# Altium schematic sheet Top Level.SchDoc
size A2
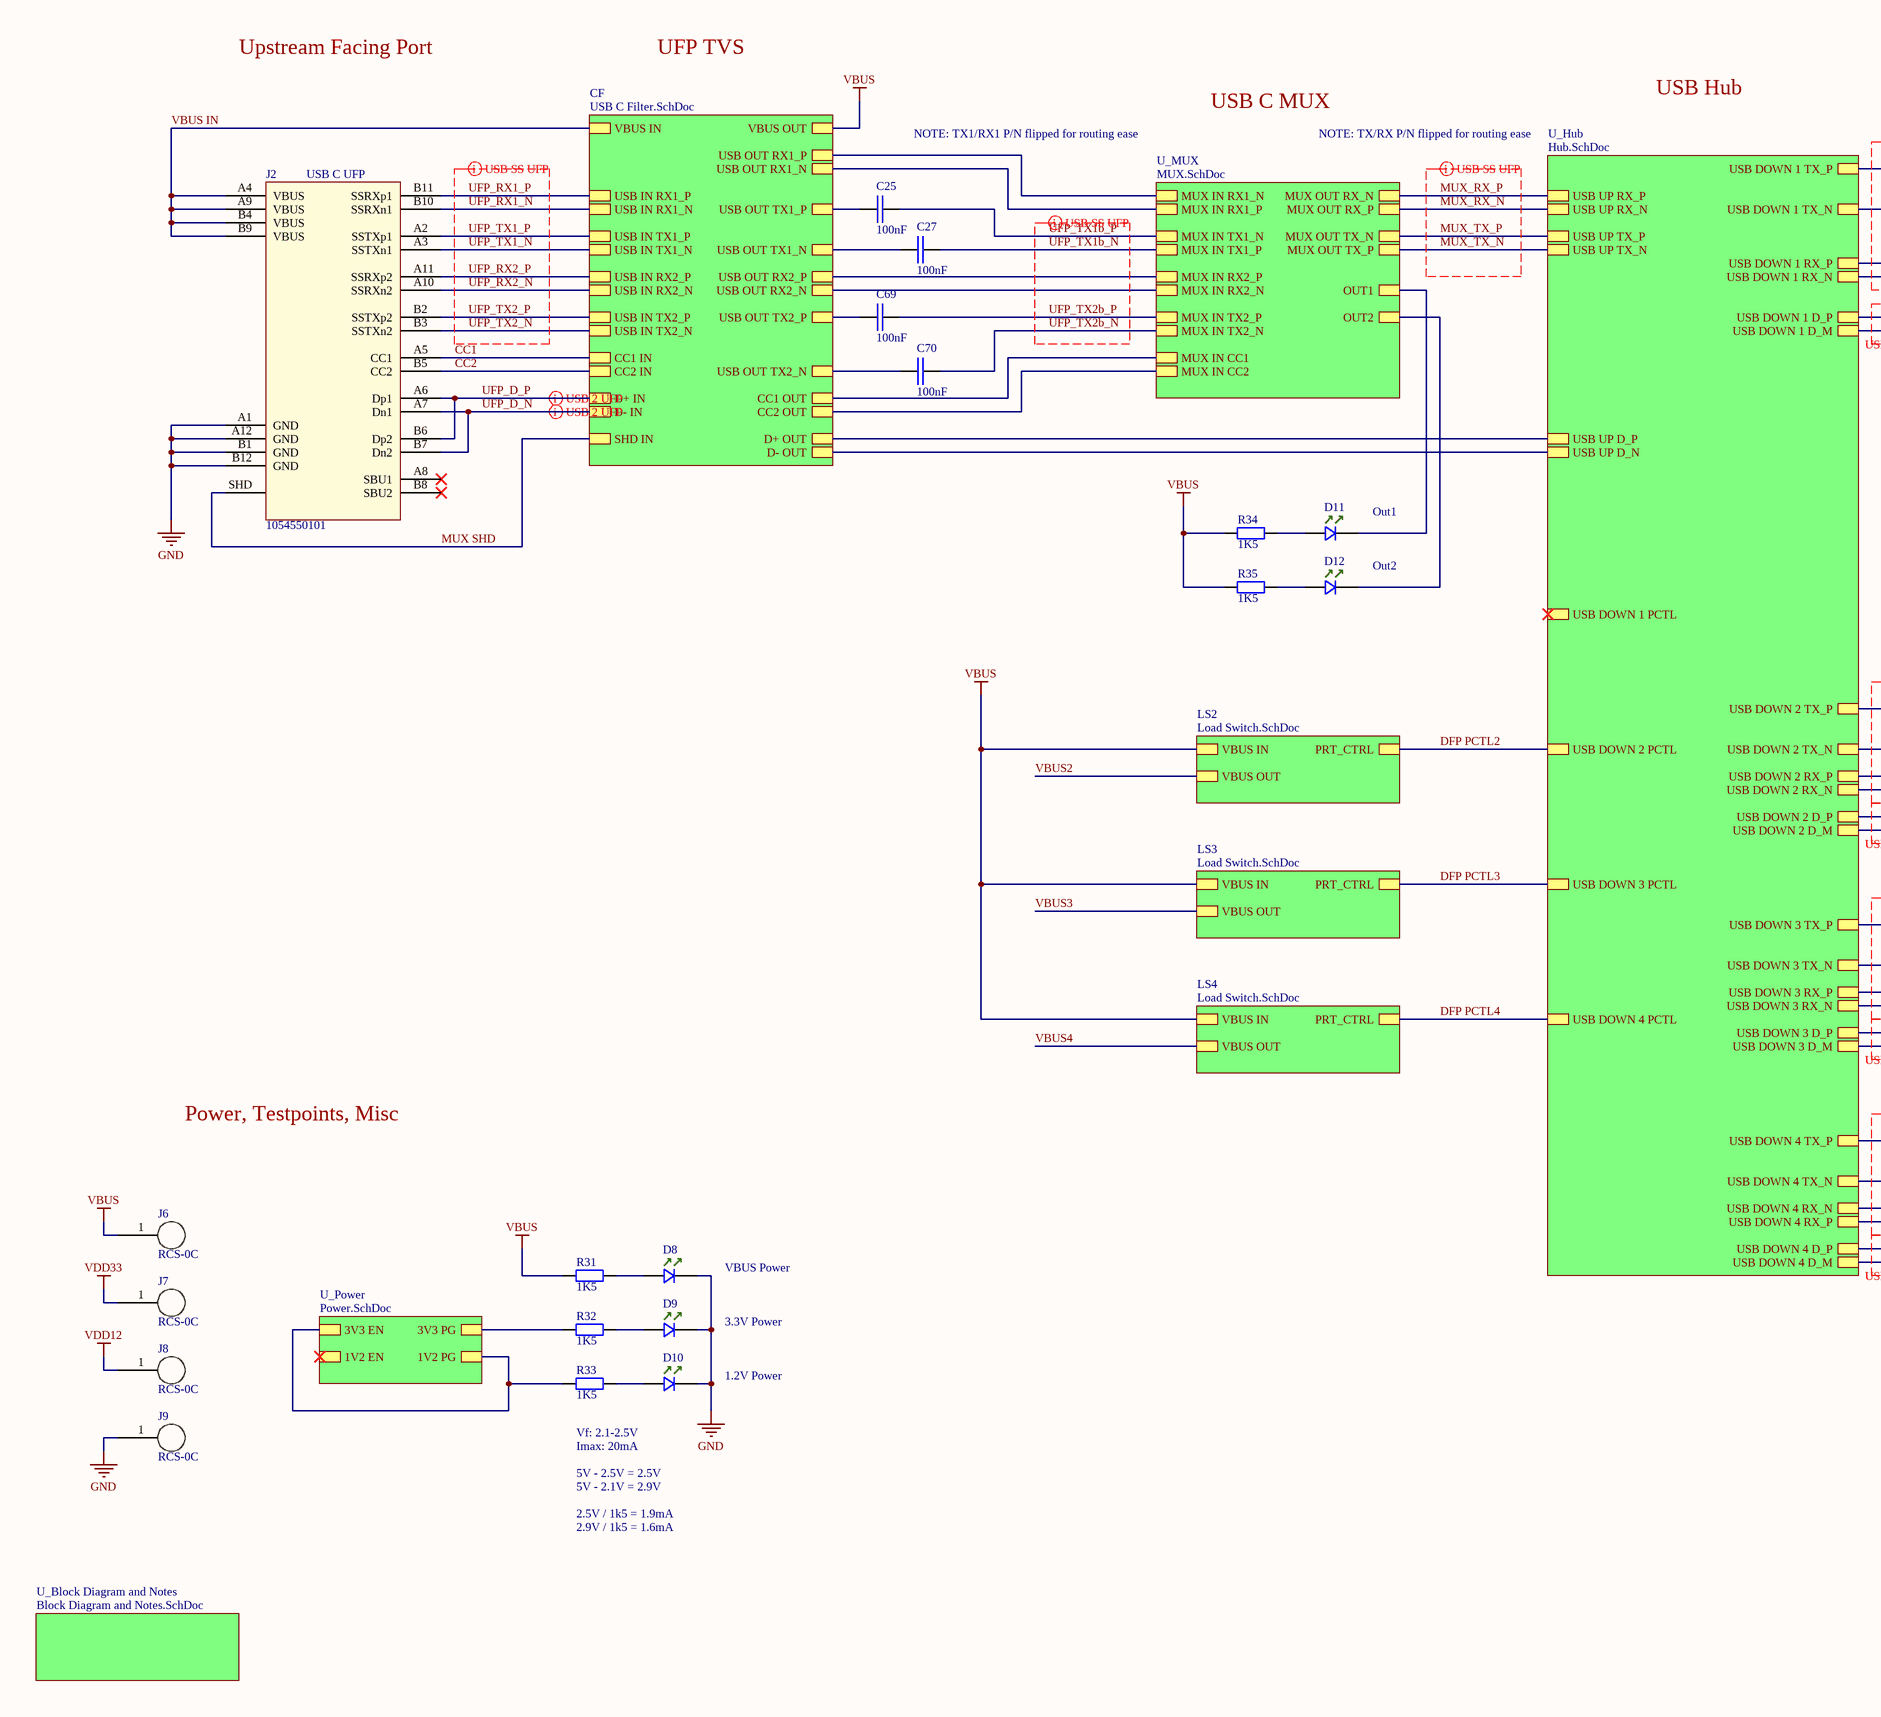
[diagram p0: Top Level.SchDoc, left]
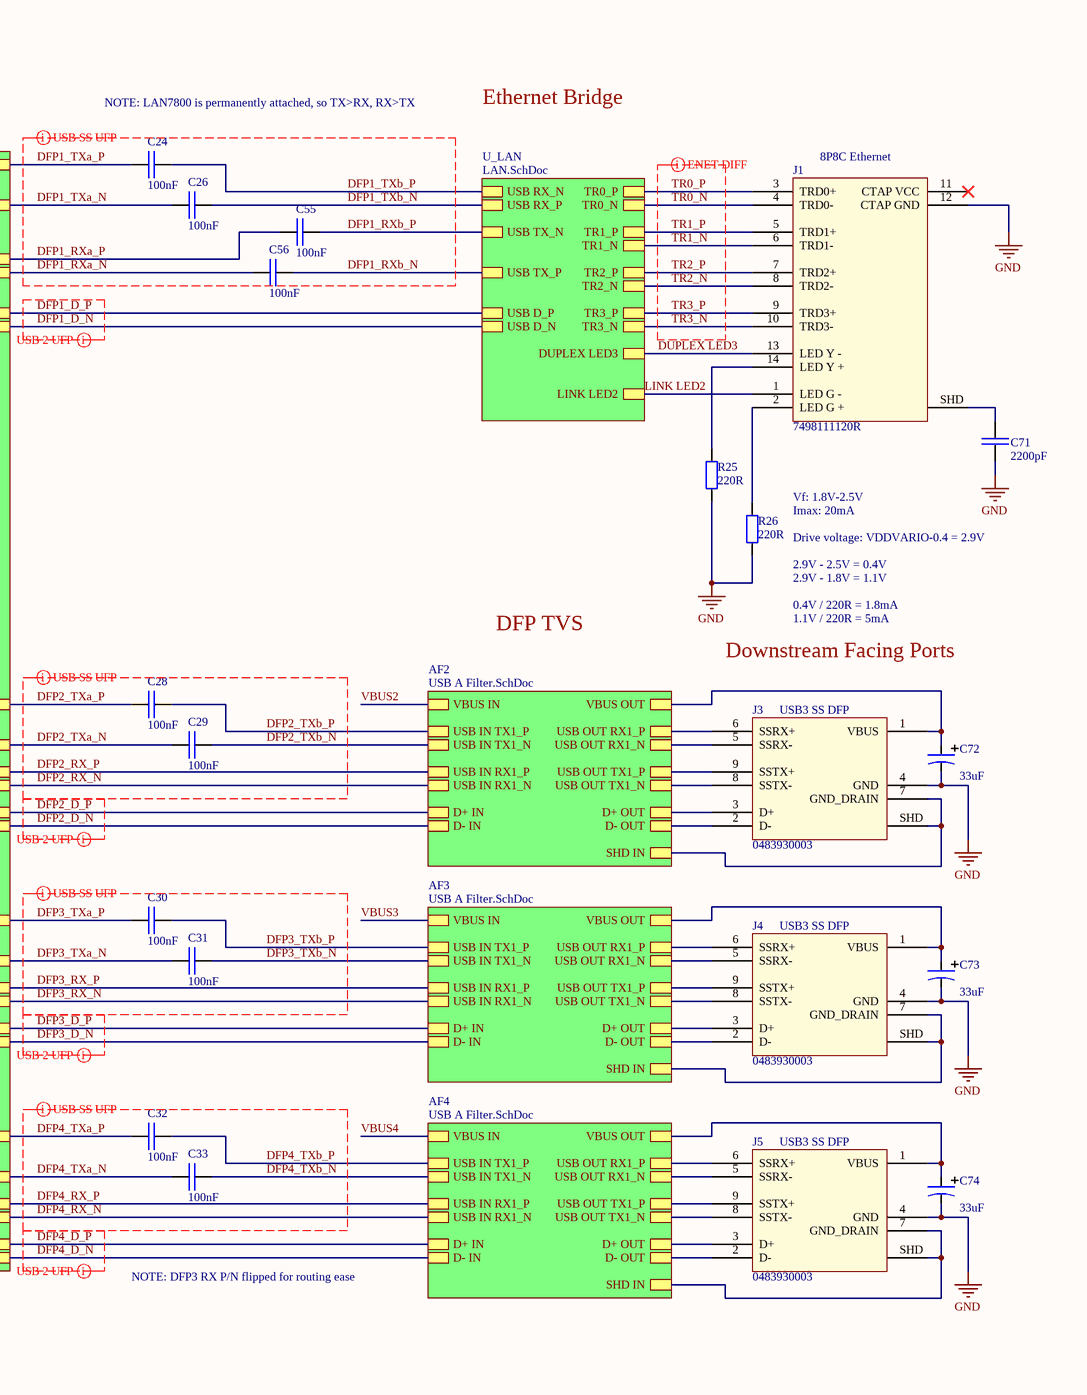
[diagram p1: Top Level.SchDoc, right]

## Parts
C24  100nF  [CAP_SM0402_YAGEOCA2_N]
C25  100nF  [CAP_SM0402_YAGEOCA2_N]
C26  100nF  [CAP_SM0402_YAGEOCA2_N]
C27  100nF  [CAP_SM0402_YAGEOCA2_N]
C28  100nF  [CAP_SM0402_YAGEOCA2_N]
C29  100nF  [CAP_SM0402_YAGEOCA2_N]
C30  100nF  [CAP_SM0402_YAGEOCA2_N]
C31  100nF  [CAP_SM0402_YAGEOCA2_N]
C32  100nF  [CAP_SM0402_YAGEOCA2_N]
C33  100nF  [CAP_SM0402_YAGEOCA2_N]
C55  100nF  [CAP_SM0402_YAGEOCA2_N]
C56  100nF  [CAP_SM0402_YAGEOCA2_N]
C69  100nF  [CAP_SM0402_YAGEOCA2_N]
C70  100nF  [CAP_SM0402_YAGEOCA2_N]
C71  2200pF  [CAP_SM1206_YAGEOCC2_N]
C72  value 33uF  [CAPAE5543X61M - EEE-FT1E330AR]  (hidden comment: EEE-FT1E330AR)
C73  value 33uF  [CAPAE5543X61M - EEE-FT1E330AR]  (hidden comment: EEE-FT1E330AR)
C74  value 33uF  [CAPAE5543X61M - EEE-FT1E330AR]  (hidden comment: EEE-FT1E330AR)
D8  SML-LXFM0603SUGCTR  [DIOC1608X11N - SML-LXFM0603SUGCTR]  (value not drawn)
D9  SML-LXFM0603SUGCTR  [DIOC1608X11N - SML-LXFM0603SUGCTR]  (value not drawn)
D10  SML-LXFM0603SUGCTR  [DIOC1608X11N - SML-LXFM0603SUGCTR]  (value not drawn)
D11  SML-LXFM0603SUGCTR  [DIOC1608X11N - SML-LXFM0603SUGCTR]  (value not drawn)
D12  SML-LXFM0603SUGCTR  [DIOC1608X11N - SML-LXFM0603SUGCTR]  (value not drawn)
J1  7498111120R  [7498111120R]
J2  1054550101  [1054550101]
J3  0483930003  [0483930003]
J4  0483930003  [0483930003]
J5  0483930003  [0483930003]
J6  RCS-0C  [RCS-0C]
J7  RCS-0C  [RCS-0C]
J8  RCS-0C  [RCS-0C]
J9  RCS-0C  [RCS-0C]
R25  220R  [RES_SM0603_YAGEORC_N]
R26  220R  [RES_SM0603_YAGEORC_N]
R31  1K5  [RES_SM0603_YAGEORC_N]
R32  1K5  [RES_SM0603_YAGEORC_N]
R33  1K5  [RES_SM0603_YAGEORC_N]
R34  1K5  [RES_SM0603_YAGEORC_N]
R35  1K5  [RES_SM0603_YAGEORC_N]

## Sub-sheets
AF2 = USB A Filter.SchDoc: USB IN RX1_P, USB IN RX1_N, USB IN TX1_P, USB IN TX1_N, D+ IN, D- IN, USB OUT RX1_P, USB OUT RX1_N, USB OUT TX1_P, USB OUT TX1_N, D+ OUT, D- OUT, SHD IN, VBUS IN, VBUS OUT
AF3 = USB A Filter.SchDoc: USB IN RX1_P, USB IN RX1_N, USB IN TX1_P, USB IN TX1_N, D+ IN, D- IN, USB OUT RX1_P, USB OUT RX1_N, USB OUT TX1_P, USB OUT TX1_N, D+ OUT, D- OUT, SHD IN, VBUS OUT, VBUS IN
AF4 = USB A Filter.SchDoc: USB IN RX1_P, USB IN RX1_N, USB IN TX1_P, USB IN TX1_N, D+ IN, D- IN, USB OUT RX1_P, USB OUT RX1_N, USB OUT TX1_P, USB OUT TX1_N, D+ OUT, D- OUT, SHD IN, VBUS IN, VBUS OUT
CF = USB C Filter.SchDoc: USB IN RX1_P, USB IN RX1_N, USB IN TX1_P, USB IN TX1_N, USB IN RX2_P, USB IN RX2_N, USB IN TX2_P, USB IN TX2_N, CC1 IN, CC2 IN, D+ IN, D- IN, USB OUT RX1_P, USB OUT RX1_N, USB OUT TX1_P, USB OUT TX1_N, USB OUT RX2_P, USB OUT RX2_N, USB OUT TX2_P, USB OUT TX2_N, CC1 OUT, CC2 OUT, D+ OUT, D- OUT, VBUS IN, VBUS OUT, SHD IN
LS2 = Load Switch.SchDoc: PRT_CTRL, VBUS IN, VBUS OUT
LS3 = Load Switch.SchDoc: PRT_CTRL, VBUS IN, VBUS OUT
LS4 = Load Switch.SchDoc: PRT_CTRL, VBUS IN, VBUS OUT
U_Block Diagram and Notes = Block Diagram and Notes.SchDoc: no entries
U_Hub = Hub.SchDoc: USB UP RX_N, USB UP RX_P, USB UP TX_N, USB UP TX_P, USB UP D_N, USB UP D_P, USB DOWN 1 PCTL, USB DOWN 2 PCTL, USB DOWN 3 PCTL, USB DOWN 4 PCTL, USB DOWN 2 RX_P, USB DOWN 2 RX_N, USB DOWN 2 TX_P, USB DOWN 2 TX_N, USB DOWN 2 D_P, USB DOWN 2 D_M, USB DOWN 3 RX_P, USB DOWN 3 RX_N, USB DOWN 3 TX_P, USB DOWN 3 TX_N, USB DOWN 3 D_P, USB DOWN 3 D_M, USB DOWN 4 D_P, USB DOWN 4 D_M, USB DOWN 4 RX_P, USB DOWN 4 RX_N, USB DOWN 4 TX_P, USB DOWN 4 TX_N, USB DOWN 1 TX_P, USB DOWN 1 TX_N, USB DOWN 1 RX_P, USB DOWN 1 RX_N, USB DOWN 1 D_P, USB DOWN 1 D_M
U_LAN = LAN.SchDoc: USB D_P, USB D_N, USB TX_P, USB TX_N, USB RX_P, USB RX_N, TR0_P, TR0_N, TR1_P, TR1_N, TR2_P, TR2_N, TR3_P, TR3_N, LINK LED2, DUPLEX LED3
U_MUX = MUX.SchDoc: MUX IN RX1_P, MUX IN RX1_N, MUX IN TX1_P, MUX IN TX1_N, MUX IN RX2_P, MUX IN RX2_N, MUX IN TX2_P, MUX IN TX2_N, MUX IN CC1, MUX IN CC2, MUX OUT RX_P, MUX OUT RX_N, MUX OUT TX_P, MUX OUT TX_N, OUT1, OUT2
U_Power = Power.SchDoc: 1V2 PG, 3V3 EN, 1V2 EN, 3V3 PG

## Nets
GND: C71.2 C72.2 C73.2 C74.2 D8.2 D9.2 D10.2 J1.12(CTAP_GND) J2.A1(GND) J2.A12(GND) J2.B1(GND) J2.B12(GND) J3.4(GND) J4.4(GND) J5.4(GND) J9.1 R25.1 R26.1
VBUS: J6.1 R31.1 R34.1 R35.1 ; sheet CF/VBUS OUT, sheet LS2/VBUS IN, sheet LS3/VBUS IN, sheet LS4/VBUS IN
VDD12: J8.1
VDD33: J7.1
CC1: J2.A5(CC1) ; sheet CF/CC1 IN
CC2: J2.B5(CC2) ; sheet CF/CC2 IN
DFP1_D_N: sheet U_Hub/USB DOWN 1 D_M, sheet U_LAN/USB D_N
DFP1_D_P: sheet U_Hub/USB DOWN 1 D_P, sheet U_LAN/USB D_P
DFP1_RXa_N: C56.1 ; sheet U_Hub/USB DOWN 1 RX_N
DFP1_RXa_P: C55.1 ; sheet U_Hub/USB DOWN 1 RX_P
DFP1_RXb_N: C56.2 ; sheet U_LAN/USB TX_P
DFP1_RXb_P: C55.2 ; sheet U_LAN/USB TX_N
DFP1_TXa_N: C26.1 ; sheet U_Hub/USB DOWN 1 TX_N
DFP1_TXa_P: C24.1 ; sheet U_Hub/USB DOWN 1 TX_P
DFP1_TXb_N: C26.2 ; sheet U_LAN/USB RX_P
DFP1_TXb_P: C24.2 ; sheet U_LAN/USB RX_N
DFP2_D_N: sheet U_Hub/USB DOWN 2 D_M, sheet AF2/D- IN
DFP2_D_P: sheet U_Hub/USB DOWN 2 D_P, sheet AF2/D+ IN
DFP2_RX_N: sheet U_Hub/USB DOWN 2 RX_N, sheet AF2/USB IN RX1_N
DFP2_RX_P: sheet U_Hub/USB DOWN 2 RX_P, sheet AF2/USB IN RX1_P
DFP2_TXa_N: C29.1 ; sheet U_Hub/USB DOWN 2 TX_N
DFP2_TXa_P: C28.1 ; sheet U_Hub/USB DOWN 2 TX_P
DFP2_TXb_N: C29.2 ; sheet AF2/USB IN TX1_N
DFP2_TXb_P: C28.2 ; sheet AF2/USB IN TX1_P
DFP3_D_N: sheet U_Hub/USB DOWN 3 D_M, sheet AF3/D- IN
DFP3_D_P: sheet U_Hub/USB DOWN 3 D_P, sheet AF3/D+ IN
DFP3_RX_N: sheet U_Hub/USB DOWN 3 RX_N, sheet AF3/USB IN RX1_N
DFP3_RX_P: sheet U_Hub/USB DOWN 3 RX_P, sheet AF3/USB IN RX1_P
DFP3_TXa_N: C31.1 ; sheet U_Hub/USB DOWN 3 TX_N
DFP3_TXa_P: C30.1 ; sheet U_Hub/USB DOWN 3 TX_P
DFP3_TXb_N: C31.2 ; sheet AF3/USB IN TX1_N
DFP3_TXb_P: C30.2 ; sheet AF3/USB IN TX1_P
DFP4_D_N: sheet U_Hub/USB DOWN 4 D_M, sheet AF4/D- IN
DFP4_D_P: sheet U_Hub/USB DOWN 4 D_P, sheet AF4/D+ IN
DFP4_RX_N: sheet U_Hub/USB DOWN 4 RX_P, sheet AF4/USB IN RX1_N
DFP4_RX_P: sheet U_Hub/USB DOWN 4 RX_N, sheet AF4/USB IN RX1_P
DFP4_TXa_N: C33.1 ; sheet U_Hub/USB DOWN 4 TX_N
DFP4_TXa_P: C32.1 ; sheet U_Hub/USB DOWN 4 TX_P
DFP4_TXb_N: C33.2 ; sheet AF4/USB IN TX1_N
DFP4_TXb_P: C32.2 ; sheet AF4/USB IN TX1_P
DFP PCTL2: sheet U_Hub/USB DOWN 2 PCTL, sheet LS2/PRT_CTRL
DFP PCTL3: sheet U_Hub/USB DOWN 3 PCTL, sheet LS3/PRT_CTRL
DFP PCTL4: sheet U_Hub/USB DOWN 4 PCTL, sheet LS4/PRT_CTRL
DUPLEX LED3: J1.13(LED_Y_-) ; sheet U_LAN/DUPLEX LED3
LINK LED2: J1.1(LED_G_-) ; sheet U_LAN/LINK LED2
MUX SHD: J2.SHD(B13) ; sheet CF/SHD IN
MUX_RX_N: sheet U_Hub/USB UP RX_N, sheet U_MUX/MUX OUT RX_P
MUX_RX_P: sheet U_Hub/USB UP RX_P, sheet U_MUX/MUX OUT RX_N
MUX_TX_N: sheet U_Hub/USB UP TX_N, sheet U_MUX/MUX OUT TX_P
MUX_TX_P: sheet U_Hub/USB UP TX_P, sheet U_MUX/MUX OUT TX_N
TR0_N: J1.4(TRD0-) ; sheet U_LAN/TR0_N
TR0_P: J1.3(TRD0+) ; sheet U_LAN/TR0_P
TR1_N: J1.6(TRD1-) ; sheet U_LAN/TR1_N
TR1_P: J1.5(TRD1+) ; sheet U_LAN/TR1_P
TR2_N: J1.8(TRD2-) ; sheet U_LAN/TR2_N
TR2_P: J1.7(TRD2+) ; sheet U_LAN/TR2_P
TR3_N: J1.10(TRD3-) ; sheet U_LAN/TR3_N
TR3_P: J1.9(TRD3+) ; sheet U_LAN/TR3_P
UFP_D_N: J2.A7(Dn1) J2.B7(Dn2) ; sheet CF/D- IN
UFP_D_P: J2.A6(Dp1) J2.B6(Dp2) ; sheet CF/D+ IN
UFP_RX1_N: J2.B10(SSRXn1) ; sheet CF/USB IN RX1_N
UFP_RX1_P: J2.B11(SSRXp1) ; sheet CF/USB IN RX1_P
UFP_RX2_N: J2.A10(SSRXn2) ; sheet CF/USB IN RX2_N
UFP_RX2_P: J2.A11(SSRXp2) ; sheet CF/USB IN RX2_P
UFP_TX1_N: J2.A3(SSTXn1) ; sheet CF/USB IN TX1_N
UFP_TX1_P: J2.A2(SSTXp1) ; sheet CF/USB IN TX1_P
UFP_TX1b_N: C27.2 ; sheet U_MUX/MUX IN TX1_P
UFP_TX1b_P: C25.2 ; sheet U_MUX/MUX IN TX1_N
UFP_TX2_N: J2.B3(SSTXn2) ; sheet CF/USB IN TX2_N
UFP_TX2_P: J2.B2(SSTXp2) ; sheet CF/USB IN TX2_P
UFP_TX2b_N: C70.2 ; sheet U_MUX/MUX IN TX2_N
UFP_TX2b_P: C69.2 ; sheet U_MUX/MUX IN TX2_P
VBUS2: sheet AF2/VBUS IN, sheet LS2/VBUS OUT
VBUS3: sheet AF3/VBUS IN, sheet LS3/VBUS OUT
VBUS4: sheet AF4/VBUS IN, sheet LS4/VBUS OUT
VBUS IN: J2.A4(VBUS) J2.A9(VBUS) J2.B4(VBUS) J2.B9(VBUS) ; sheet CF/VBUS IN
NetC25_1: C25.1 ; sheet CF/USB OUT TX1_P
NetC27_1: C27.1 ; sheet CF/USB OUT TX1_N
NetC69_1: C69.1 ; sheet CF/USB OUT TX2_P
NetC70_1: C70.1 ; sheet CF/USB OUT TX2_N
NetC71_1: C71.1 J1.SHD
NetC72_1: C72.1 J3.1(VBUS) ; sheet AF2/VBUS OUT
NetC73_1: C73.1 J4.1(VBUS) ; sheet AF3/VBUS OUT
NetC74_1: C74.1 J5.1(VBUS) ; sheet AF4/VBUS OUT
NetD8_1: D8.1 R31.2
NetD9_1: D9.1 R32.2
NetD10_1: D10.1 R33.2
NetD11_1: D11.1 R34.2
NetD11_2: D11.2 ; sheet U_MUX/OUT1
NetD12_1: D12.1 R35.2
NetD12_2: D12.2 ; sheet U_MUX/OUT2
NetJ1_2: J1.2(LED_G_+) R26.2
NetJ1_14: J1.14(LED_Y_+) R25.2
NetJ3_2: J3.2(D-) ; sheet AF2/D- OUT
NetJ3_3: J3.3(D+) ; sheet AF2/D+ OUT
NetJ3_5: J3.5(SSRX-) ; sheet AF2/USB OUT RX1_N
NetJ3_6: J3.6(SSRX+) ; sheet AF2/USB OUT RX1_P
NetJ3_7: J3.7(GND_DRAIN) J3.SHD(B13) ; sheet AF2/SHD IN
NetJ3_8: J3.8(SSTX-) ; sheet AF2/USB OUT TX1_N
NetJ3_9: J3.9(SSTX+) ; sheet AF2/USB OUT TX1_P
NetJ4_2: J4.2(D-) ; sheet AF3/D- OUT
NetJ4_3: J4.3(D+) ; sheet AF3/D+ OUT
NetJ4_5: J4.5(SSRX-) ; sheet AF3/USB OUT RX1_N
NetJ4_6: J4.6(SSRX+) ; sheet AF3/USB OUT RX1_P
NetJ4_7: J4.7(GND_DRAIN) J4.SHD(B13) ; sheet AF3/SHD IN
NetJ4_8: J4.8(SSTX-) ; sheet AF3/USB OUT TX1_N
NetJ4_9: J4.9(SSTX+) ; sheet AF3/USB OUT TX1_P
NetJ5_2: J5.2(D-) ; sheet AF4/D- OUT
NetJ5_3: J5.3(D+) ; sheet AF4/D+ OUT
NetJ5_5: J5.5(SSRX-) ; sheet AF4/USB OUT RX1_N
NetJ5_6: J5.6(SSRX+) ; sheet AF4/USB OUT RX1_P
NetJ5_7: J5.7(GND_DRAIN) J5.SHD(B13) ; sheet AF4/SHD IN
NetJ5_8: J5.8(SSTX-) ; sheet AF4/USB OUT TX1_N
NetJ5_9: J5.9(SSTX+) ; sheet AF4/USB OUT TX1_P
NetR32_1: R32.1 ; sheet U_Power/3V3 PG
NetR33_1: R33.1 ; sheet U_Power/1V2 PG, sheet U_Power/3V3 EN
(unnamed): sheet U_Hub/USB UP D_N, sheet CF/D- OUT
(unnamed): sheet U_Hub/USB UP D_P, sheet CF/D+ OUT
(unnamed): sheet U_MUX/MUX IN RX1_P, sheet CF/USB OUT RX1_N
(unnamed): sheet U_MUX/MUX IN RX1_N, sheet CF/USB OUT RX1_P
(unnamed): sheet U_MUX/MUX IN RX2_P, sheet CF/USB OUT RX2_P
(unnamed): sheet U_MUX/MUX IN RX2_N, sheet CF/USB OUT RX2_N
(unnamed): sheet U_MUX/MUX IN CC1, sheet CF/CC1 OUT
(unnamed): sheet U_MUX/MUX IN CC2, sheet CF/CC2 OUT

Not connected (* = marked no-connect by the designer): J1 11(CTAP_VCC)*; J2 A8(SBU1)* B8(SBU2)*

## Layout directives
differential pair; net class DIFF90SS: DFP1_RXa_N, DFP1_RXa_P, DFP1_RXb_N, DFP1_RXb_P, DFP1_TXa_N, DFP1_TXa_P, DFP1_TXb_N, DFP1_TXb_P, DFP2_RX_N, DFP2_RX_P, DFP2_TXa_N, DFP2_TXa_P, DFP2_TXb_N, DFP2_TXb_P, DFP3_RX_N, DFP3_RX_P, DFP3_TXa_N, DFP3_TXa_P, DFP3_TXb_N, DFP3_TXb_P, DFP4_RX_N, DFP4_RX_P, DFP4_TXa_N, DFP4_TXa_P, DFP4_TXb_N, DFP4_TXb_P, MUX_RX_N, MUX_RX_P, MUX_TX_N, MUX_TX_P, UFP_RX1_N, UFP_RX1_P, UFP_RX2_N, UFP_RX2_P, UFP_TX1_N, UFP_TX1_P, UFP_TX1b_N, UFP_TX1b_P, UFP_TX2_N, UFP_TX2_P, UFP_TX2b_N, UFP_TX2b_P
differential pair; net class DIFF90HS: DFP1_D_N, DFP1_D_P, DFP2_D_N, DFP2_D_P, DFP3_D_N, DFP3_D_P, DFP4_D_N, DFP4_D_P, UFP_D_N, UFP_D_P
differential pair; net class DIFF100: TR0_N, TR0_P, TR1_N, TR1_P, TR2_N, TR2_P, TR3_N, TR3_P

## Notes on the sheet
- Upstream Facing Port
- UFP TVS
- NOTE: TX1/RX1 P/N flipped for routing ease
- USB C MUX
- NOTE: TX/RX P/N flipped for routing ease
- USB Hub
- NOTE: LAN7800 is permanently attached, so TX>RX, RX>TX
- Ethernet Bridge
- (near J2) USB C UFP
- (near J1) 8P8C Ethernet
- (near D11) Out1
- Out2
- Vf: 1.8V-2.5V
  Imax: 20mA
  Drive voltage: VDDVARIO-0.4 = 2.9V
  2.9V - 2.5V = 0.4V
  2.9V - 1.8V = 1.1V
  0.4V / 220R = 1.8mA
  1.1V / 220R = 5mA
- DFP TVS
- Downstream Facing Ports
- (near J3) USB3 SS DFP
- (near J4) USB3 SS DFP
- Power, Testpoints, Misc
- (near J5) USB3 SS DFP
- VBUS Power
- NOTE: DFP3 RX P/N flipped for routing ease
- 3.3V Power
- 1.2V Power
- Vf: 2.1-2.5V
  Imax: 20mA
  5V - 2.5V = 2.5V
  5V - 2.1V = 2.9V
  2.5V / 1k5 = 1.9mA
  2.9V / 1k5 = 1.6mA

## Library data of the parts
C24-C33 C55 C56 C69 C70 = CC0402KRX7R9BB104: CAP 100nF SM0805 X7R 50V YAGEO CC2; Tolerance (%): 10; Voltage Rating (Volts): 50; Category: Capacitor; Manufacturer: Yageo; Manufacturer Part Number: CC0402KRX7R9BB104; Package: 0402; Value: 100nF; ComponentLink1URL: http://www.yageo.com; ComponentLink1Description: Manufacturer Website; Supplier 2: Digi-Key; Supplier Part Number 2: 311-3566-1-ND
C71 = CC1206KKX7RCBB222: CAP 2200pF SM1206 X7R 1000V YAGEO CC2; Tolerance (%): 10; Voltage Rating (Volts): 1000; Category: Capacitor; Manufacturer: Yageo; Manufacturer Part Number: CC1206KKX7RCBB222; Package: 1206; Value: 2200pF; ComponentLink1URL: http://www.yageo.com; ComponentLink1Description: Manufacturer Website; Supplier 2: Farnell; Supplier Part Number 2: 1284147RL
C72-C74 = EEE-FT1E330AR: CAP ALUM 33UF 20% 25V SMD
D8-D12 = SML-LXFM0603SUGCTR: LED GREEN CLEAR SMD
J1 = 7498111120R: CONN JACK 1PORT 1000 BASE-T SMD
J2 = 1054550101: CONN RCP USB3.1 TYPEC 24P SMD RA
J3-J5 = 0483930003: CONN RCPT USB3.0 TYPEA 9POS R/A
R25 R26 = RC0603FR-07220RL: RES 220R SM0603 YAGEO RC_L; Power (Watts): 0.1; Resistance (Ohms): 220; Tolerance (%): 1; Category: Resistor; Manufacturer: Yageo; Manufacturer Part Number: RC0603FR-07220RL; Package: 0603; Value: 220R; Supplier Part Number 1: 2421863; Supplier 1: Farnell; ComponentLink1URL: http://www.yageo.com; ComponentLink1Description: Manufacturer Website; Supplier 2: Digi-Key; Supplier Part Number 2: 311-220HRCT-ND
R31-R35 = RC0603FR-071K5L: RES 1K5 SM0603 YAGEO RC_L; Power (Watts): 0.1; Resistance (Ohms): 1500; Tolerance (%): 1; Category: Resistor; Manufacturer: Yageo; Manufacturer Part Number: RC0603FR-071K5L; Package: 0603; Value: 1K5; Supplier Part Number 1: 9238506; Supplier 1: Farnell; ComponentLink1URL: http://www.yageo.com; ComponentLink1Description: Manufacturer Website; Supplier 2: Digi-Key; Supplier Part Number 2: 311-1.50KHRCT-ND